# EAGLE design Vernier_Interface_Shield2 (EAGLE 6.5.0)
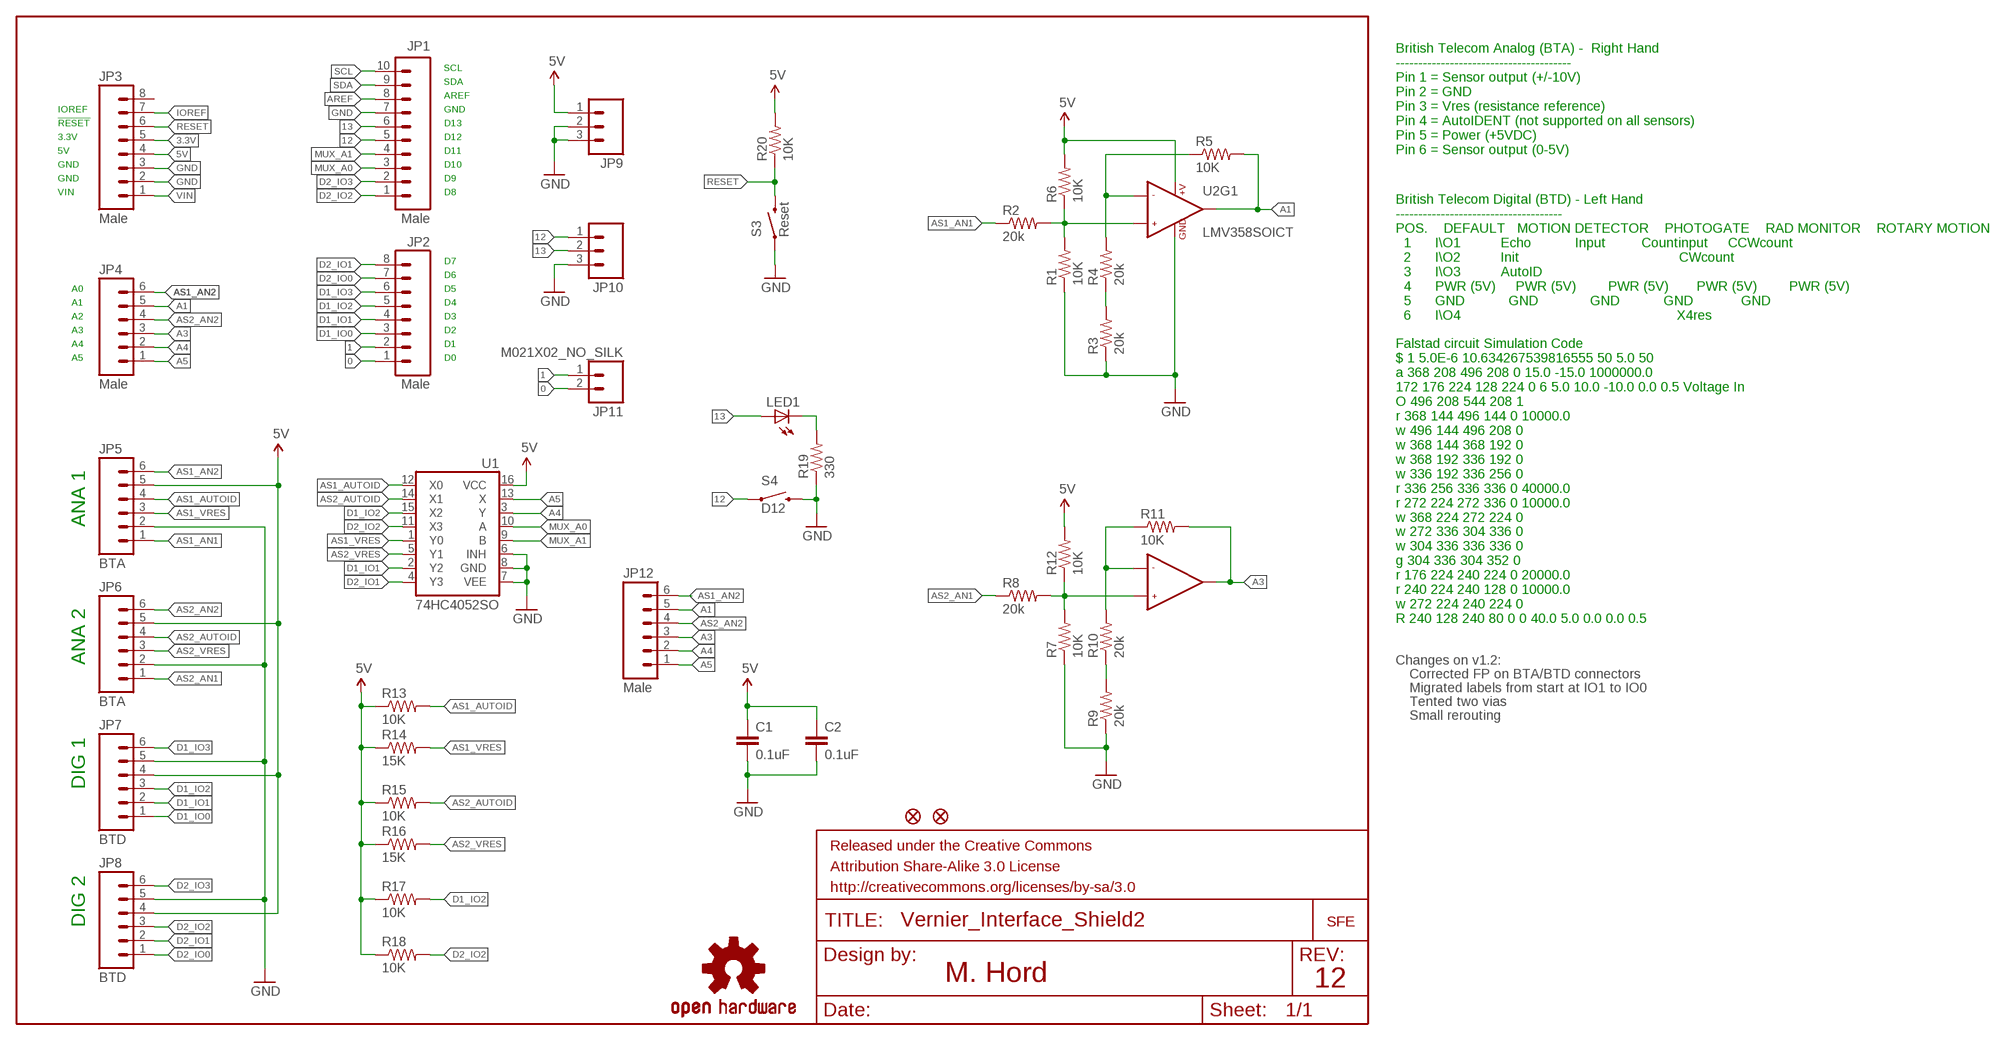
[diagram p0: schematic, sheet 1]

## Parts
C1  0.1uF  0.1UF-25V(+80/-20%)(0603)  [0603-CAP]
C2  0.1uF  0.1UF-25V(+80/-20%)(0603)  [0603-CAP]
FID1  FIDUCIALUFIDUCIAL  [MICRO-FIDUCIAL]
FID2  FIDUCIALUFIDUCIAL  [MICRO-FIDUCIAL]
FRAME1  FRAME-LETTER  [CREATIVE_COMMONS]
JP1  Male  M10SMD_MALE  [1X10_SMD_MALE]
JP2  Male  M08SMD-MALE  [1X08_SMD_MALE]
JP3  Male  M08SMD-MALE  [1X08_SMD_MALE]
JP4  Male  M06SMD_MALE  [1X06_SMD_MALE]
JP5  BTA  M06VERNIER-ANALOG  [BTA]
JP6  BTA  M06VERNIER-ANALOG  [BTA]
JP7  BTD  M06VERNIER-DIGITAL  [BTD]
JP8  BTD  M06VERNIER-DIGITAL  [BTD]
JP9  M031X03_NO_SILK  [1X03_NO_SILK]
JP10  M031X03_NO_SILK  [1X03_NO_SILK]
JP11  M021X02_NO_SILK  [1X02_NO_SILK]
JP12  Male  M06SIP  [1X06]
LED1  LED5MM  [LED5MM]
LOGO2  OSHW-LOGOS  [OSHW-LOGO-S]
LOGO_1  LOGO-SFESK  [SFE-LOGO-FLAME]
R1  10K  10KOHM1/10W1%(0603)0603  [0603-RES]
R2  20k  20KOHM1/10W1%(0603)  [0603-RES]
R3  20k  20KOHM1/10W1%(0603)  [0603-RES]
R4  20k  20KOHM1/10W1%(0603)  [0603-RES]
R5  10K  10KOHM1/10W1%(0603)0603  [0603-RES]
R6  10K  10KOHM1/10W1%(0603)0603  [0603-RES]
R7  10K  10KOHM1/10W1%(0603)0603  [0603-RES]
R8  20k  20KOHM1/10W1%(0603)  [0603-RES]
R9  20k  20KOHM1/10W1%(0603)  [0603-RES]
R10  20k  20KOHM1/10W1%(0603)  [0603-RES]
R11  10K  10KOHM1/10W1%(0603)0603  [0603-RES]
R12  10K  10KOHM1/10W1%(0603)0603  [0603-RES]
R13  10K  10KOHM1/10W1%(0603)0603  [0603-RES]
R14  15K  15KOHM1/10W1%(0603)0603  [0603-RES]
R15  10K  10KOHM1/10W1%(0603)0603  [0603-RES]
R16  15K  15KOHM1/10W1%(0603)0603  [0603-RES]
R17  10K  10KOHM1/10W1%(0603)0603  [0603-RES]
R18  10K  10KOHM1/10W1%(0603)0603  [0603-RES]
R19  330  330OHM1/10W1%(0603)  [0603-RES]
R20  10K  10KOHM1/10W1%(0603)0603  [0603-RES]
S3  Reset  SWITCH-MOMENTARY-2PTH  [TACTILE-PTH]
S4  D12  SWITCH-MOMENTARY-2PTH  [TACTILE-PTH]
U1  74HC4052SO  [SO16]
U2  LMV358SOICT  [SO08-TIGHT]

## Nets
0: JP2.1 JP11.2
1: JP2.2 JP11.1
3.3V: JP3.5
5V: C1.1 C2.1 JP3.4 JP5.5 JP6.5 JP7.4 JP8.4 JP9.1 R6.2 R12.2 R13.1 R14.1 R15.1 R16.1 R17.1 R18.1 R20.2 U1.16(VCC) U2.8(+V)
12: JP1.5 JP10.1 S4.1
13: JP1.6 JP10.2 LED1.A
A1: JP4.5 JP12.5 R5.2 U2.1(OUT1)
A3: JP4.3 JP12.3 R11.2 U2.7(OUT2)
A4: JP4.2 JP12.2 U1.3(Y)
A5: JP4.1 JP12.1 U1.13(X)
AREF: JP1.8
AS1_AN1: JP5.1 R2.1
AS1_AN2: JP4.6 JP5.6 JP12.6
AS1_AUTOID: JP5.4 R13.2 U1.12(X0)
AS1_VRES: JP5.3 R14.2 U1.1(Y0)
AS2_AN1: JP6.1 R8.1
AS2_AN2: JP4.4 JP6.6 JP12.4
AS2_AUTOID: JP6.4 R15.2 U1.14(X1)
AS2_VRES: JP6.3 R16.2 U1.5(Y1)
D1_IO0: JP2.3 JP7.1
D1_IO1: JP2.4 JP7.2 U1.2(Y2)
D1_IO2: JP2.5 JP7.3 R17.2 U1.15(X2)
D1_IO3: JP2.6 JP7.6
D2_IO0: JP2.7 JP8.1
D2_IO1: JP2.8 JP8.2 U1.4(Y3)
D2_IO2: JP1.1 JP8.3 R18.2 U1.11(X3)
D2_IO3: JP1.2 JP8.6
GND: C1.2 C2.2 JP1.7 JP3.2 JP3.3 JP5.2 JP6.2 JP7.5 JP8.5 JP9.2 JP9.3 JP10.3 R1.1 R3.1 R7.1 R9.1 R19.1 S3.1 S4.3 U1.6(INH) U1.7(VEE) U1.8(GND) U2.4(GND)
IOREF: JP3.7
MUX_A0: JP1.3 U1.10(A)
MUX_A1: JP1.4 U1.9(B)
N$1: R1.2 R2.2 R6.1 U2.3(+IN1)
N$2: R3.2 R4.1
N$3: R4.2 R5.1 U2.2(-IN1)
N$5: R9.2 R10.1
N$6: R7.2 R8.2 R12.1 U2.5(+IN2)
N$8: R10.2 R11.1 U2.6(-IN2)
N$9: LED1.K(C) R19.2
RESET: JP3.6 R20.1 S3.3
SCL: JP1.10
SDA: JP1.9
VIN: JP3.1
Unconnected: JP3.8

## Notes on the sheet
- SCL
- SDA
- AREF
- IOREF | GND
- !RESET | D13
- 3.3V | D12
- 5V | D11
- British Telecom Analog (BTA) -  Right Hand
  ---------------------------------------
  Pin 1 = Sensor output (+/-10V)
  Pin 2 = GND
  Pin 3 = Vres (resistance reference)
  Pin 4 = AutoIDENT (not supported on all sensors)
  Pin 5 = Power (+5VDC)
  Pin 6 = Sensor output (0-5V)
- GND | D10
- GND | D9
- VIN | D8
- D7
- D6
- A0 | D5
- A1 | D4
- A2 | D3
- British Telecom Digital (BTD) - Left Hand
  -------------------------------------
  POS.    DEFAULT   MOTION DETECTOR    PHOTOGATE    RAD MONITOR    ROTARY MOTION
    1      I\\O1          Echo           Input         Countinput     CCWcount 
    2      I\\O2          Init                                        CWcount 
    3      I\\O3          AutoID            
    4      PWR (5V)     PWR (5V)        PWR (5V)       PWR (5V)        PWR (5V)
    5      GND           GND             GND           GND            GND
    6      I\\O4                                                      X4res
- A3 | D2
- A4 | D1
- A5 | D0
- ANA 1
- Falstad circuit Simulation Code
  $ 1 5.0E-6 10.634267539816555 50 5.0 50
  a 368 208 496 208 0 15.0 -15.0 1000000.0
  172 176 224 128 224 0 6 5.0 10.0 -10.0 0.0 0.5 Voltage In
  O 496 208 544 208 1
  r 368 144 496 144 0 10000.0
  w 496 144 496 208 0
  w 368 144 368 192 0
  w 368 192 336 192 0
  w 336 192 336 256 0
  r 336 256 336 336 0 40000.0
  r 272 224 272 336 0 10000.0
  w 368 224 272 224 0
  w 272 336 304 336 0
  w 304 336 336 336 0
  g 304 336 304 352 0
  r 176 224 240 224 0 20000.0
  r 240 224 240 128 0 10000.0
  w 272 224 240 224 0
  R 240 128 240 80 0 0 40.0 5.0 0.0 0.0 0.5
- ANA 2 | Changes on v1.2:
- Corrected FP on BTA/BTD connectors
- Migrated labels from start at IO1 to IO0
- Tented two vias
- Small rerouting
- DIG 1
- DIG 2
- M. Hord | 12

## Library data of the parts
C1 C2 = SparkFun-Capacitors:0.1UF-25V(+80/-20%)(0603): CAP-00810 Ceramic Standard decoupling cap; PROD_ID: CAP-00810
FID1 FID2 = SparkFun-Aesthetics:FIDUCIAL: Fiducial Alignment Points Various fiducial points for machine vision alignment.
FRAME1 = SparkFun-Aesthetics:FRAME-LETTER: Schematic Frame Standard 8.5x11 US Letter frame
JP1 = SparkFun-Connectors:M10: Header 10 Standard 10-pin 0.1" header. Use with straight break away headers (SKU : PRT-00116), right angle break away headers (PRT-00553), swiss pins (PRT-00743), machine pins (PRT-00117), and female headers (PRT-00115).; PROD_ID: CONN-11291
JP2 JP3 = SparkFun-Connectors:M08: Header 8 Standard 8-pin 0.1" header. Use with straight break away headers (SKU : PRT-00116), right angle break away headers (PRT-00553), swiss pins (PRT-00743), machine pins (PRT-00117), and female headers (PRT-00115).; PROD_ID: CONN-11292
JP4 = SparkFun-Connectors:M06: Header 6 Standard 6-pin 0.1" header. Use with straight break away headers (SKU : PRT-00116), right angle break away headers (PRT-00553), swiss pins (PRT-00743), machine pins (PRT-00117), and female headers (PRT-00115). Molex polarized connector foot print use with SKU : PRT-08094 with associated crimp pins and housings. NOTES ON THE VARIANTS LOCK and LOCK_LONGPADS... This footprint was designed to help hold the alignment of a through-hole component (i.e. 6-pin header) while soldering it into place. You may notice that each hole has been shifted either up or down by 0.005 of an inch from it's more standard position (which is a perfectly straight line). This slight alteration caused the pins (the squares in the middle) to touch the edges of the holes. Because they are alternating, it causes a "brace" to hold the component in place. 0.005 has proven to be the perfect amount of "off-center" position when using our standard breakaway headers. Although looks a little odd when you look at the bare footprint, once you have a header in there, the alteration is very hard to notice. Also,if you push a header all the way into place, it is covered up entirely on the bottom side. This idea of altering the position of holes to aid alignment will be further integrated into the Sparkfun Library for other footprints. It can help hold any component with 3 or more connection pins.; PROD_ID: CONN-11293
JP5-JP8 JP12 = SparkFun-Connectors:M06: Header 6 Standard 6-pin 0.1" header. Use with straight break away headers (SKU : PRT-00116), right angle break away headers (PRT-00553), swiss pins (PRT-00743), machine pins (PRT-00117), and female headers (PRT-00115). Molex polarized connector foot print use with SKU : PRT-08094 with associated crimp pins and housings. NOTES ON THE VARIANTS LOCK and LOCK_LONGPADS... This footprint was designed to help hold the alignment of a through-hole component (i.e. 6-pin header) while soldering it into place. You may notice that each hole has been shifted either up or down by 0.005 of an inch from it's more standard position (which is a perfectly straight line). This slight alteration caused the pins (the squares in the middle) to touch the edges of the holes. Because they are alternating, it causes a "brace" to hold the component in place. 0.005 has proven to be the perfect amount of "off-center" position when using our standard breakaway headers. Although looks a little odd when you look at the bare footprint, once you have a header in there, the alteration is very hard to notice. Also,if you push a header all the way into place, it is covered up entirely on the bottom side. This idea of altering the position of holes to aid alignment will be further integrated into the Sparkfun Library for other footprints. It can help hold any component with 3 or more connection pins.
JP9 JP10 = SparkFun-Connectors:M03: Header 3 Standard 3-pin 0.1" header. Use with straight break away headers (SKU : PRT-00116), right angle break away headers (PRT-00553), swiss pins (PRT-00743), machine pins (PRT-00117), and female headers (PRT-00115). Molex polarized connector foot print use with SKU : PRT-08232 with associated crimp pins and housings.
JP11 = SparkFun-Connectors:M02: Standard 2-pin 0.1" header. Use with - straight break away headers ( PRT-00116) - right angle break away headers (PRT-00553) - swiss pins (PRT-00743) - machine pins (PRT-00117) - female headers (PRT-00115) Molex polarized connector foot print use with: PRT-08233 with associated crimp pins and housings. 2.54_SCREWTERM for use with PRT-10571. 3.5mm Screw Terminal footprints for PRT-08084 5mm Screw Terminal footprints for use with PRT-08433
LED1 = SparkFun-LED:LED: LEDs Standard schematic elements and footprints for 5mm, 3mm, 1206, and 0603 sized LEDs. 5mm - Spark Fun Electronics SKU : COM-00529 (and others)
LOGO2 = SparkFun-Aesthetics:OSHW-LOGO: Open Source Hardware Logo This logo indicates the piece of hardware it is found on incorporates a OSHW license and/or adheres to the definition of open source hardware found here: http://freedomdefined.org/OSHW
LOGO_1 = SparkFun-Aesthetics:LOGO-SFE: Spark Fun Electronics PCB Logo This is the standard Spark Fun Electronics PCB logo.
R1 R5-R7 R11-R13 R15 R17 R18 R20 = SparkFun-Resistors:10KOHM1/10W1%(0603): RES-00824; PROD_ID: RES-00824
R2-R4 R8-R10 = SparkFun-Resistors:20KOHM1/10W1%(0603): RES-09383; PROD_ID: RES-09383
R14 R16 = SparkFun-Resistors:15KOHM1/10W1%(0603): RES-07854; PROD_ID: RES-07854
R19 = SparkFun-Resistors:330OHM1/10W1%(0603): RES-00818; PROD_ID: RES-00818
S3 S4 = SparkFun-Electromechanical:SWITCH-MOMENTARY-2: Various NO switches- pushbuttons, reed, etc
U1 = SparkFun-AnalogIC:74HC4052: Dual 4:1 analog mux; PROD_ID: IC-09813; VALUE: 74HC4052
U2 = SparkFun-AnalogIC:LMV358: Jellybean rail-to-rail output op-amp; PROD_ID: IC-09657

## Board
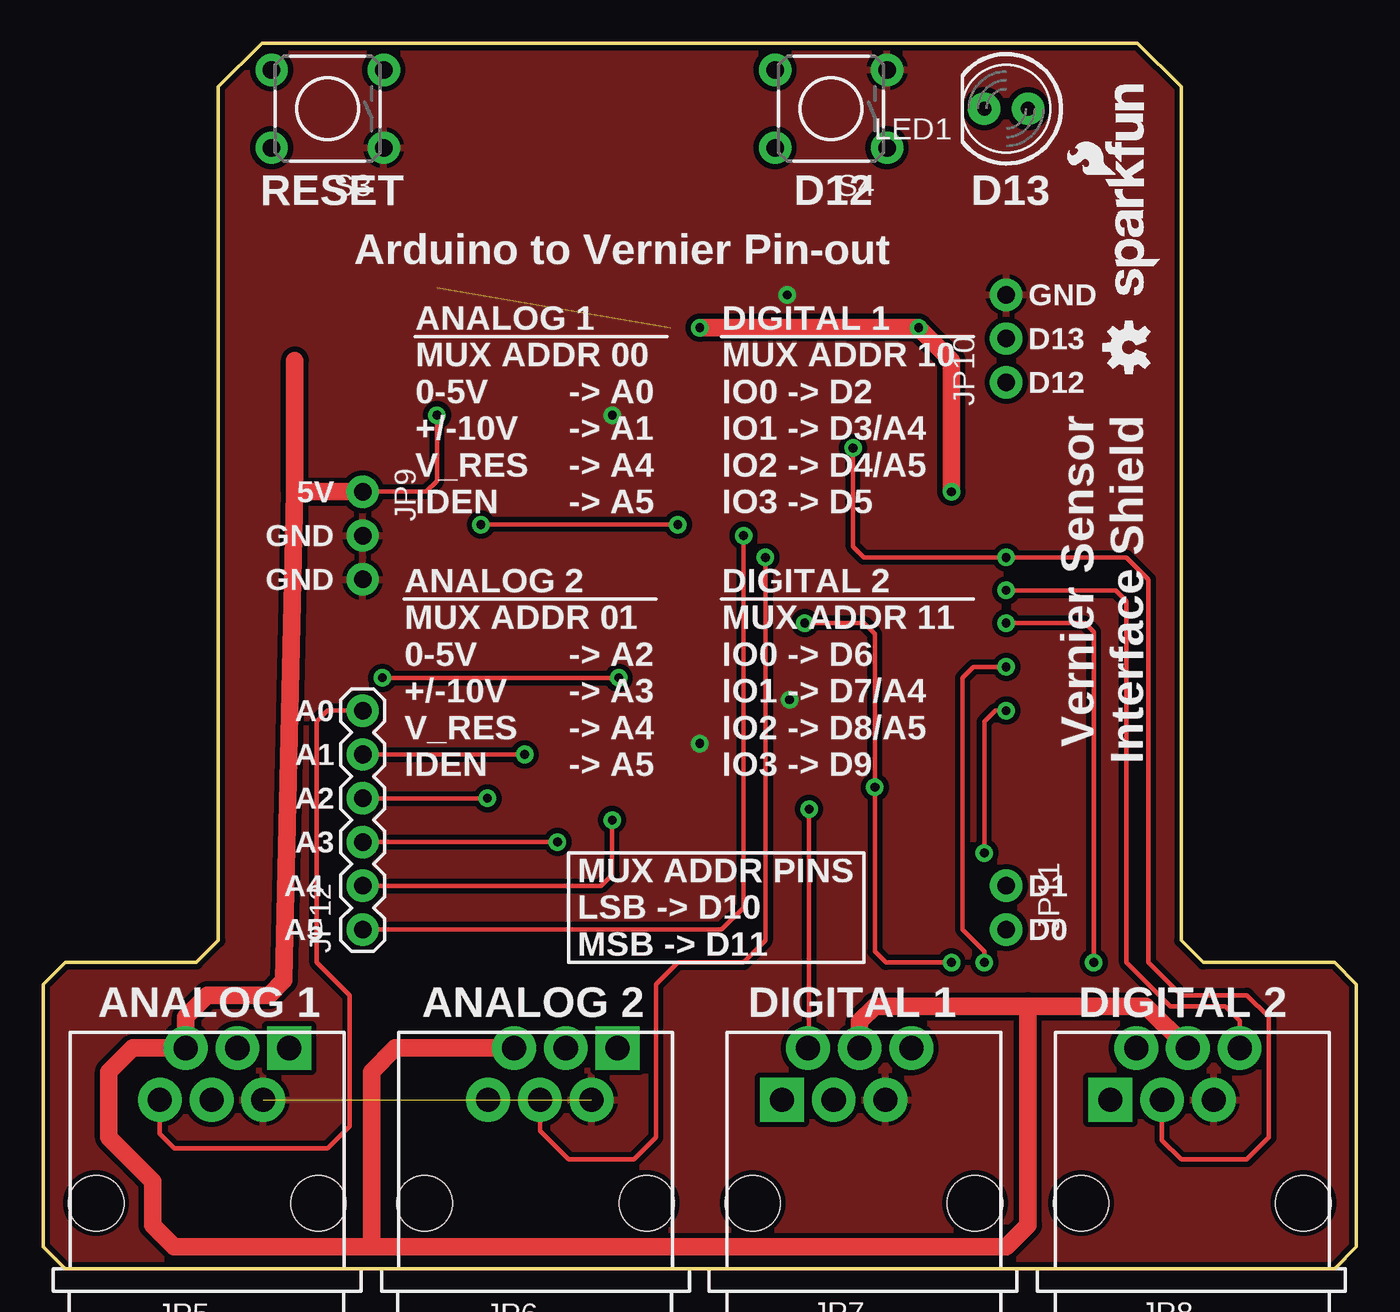
[diagram p1: board, top side]
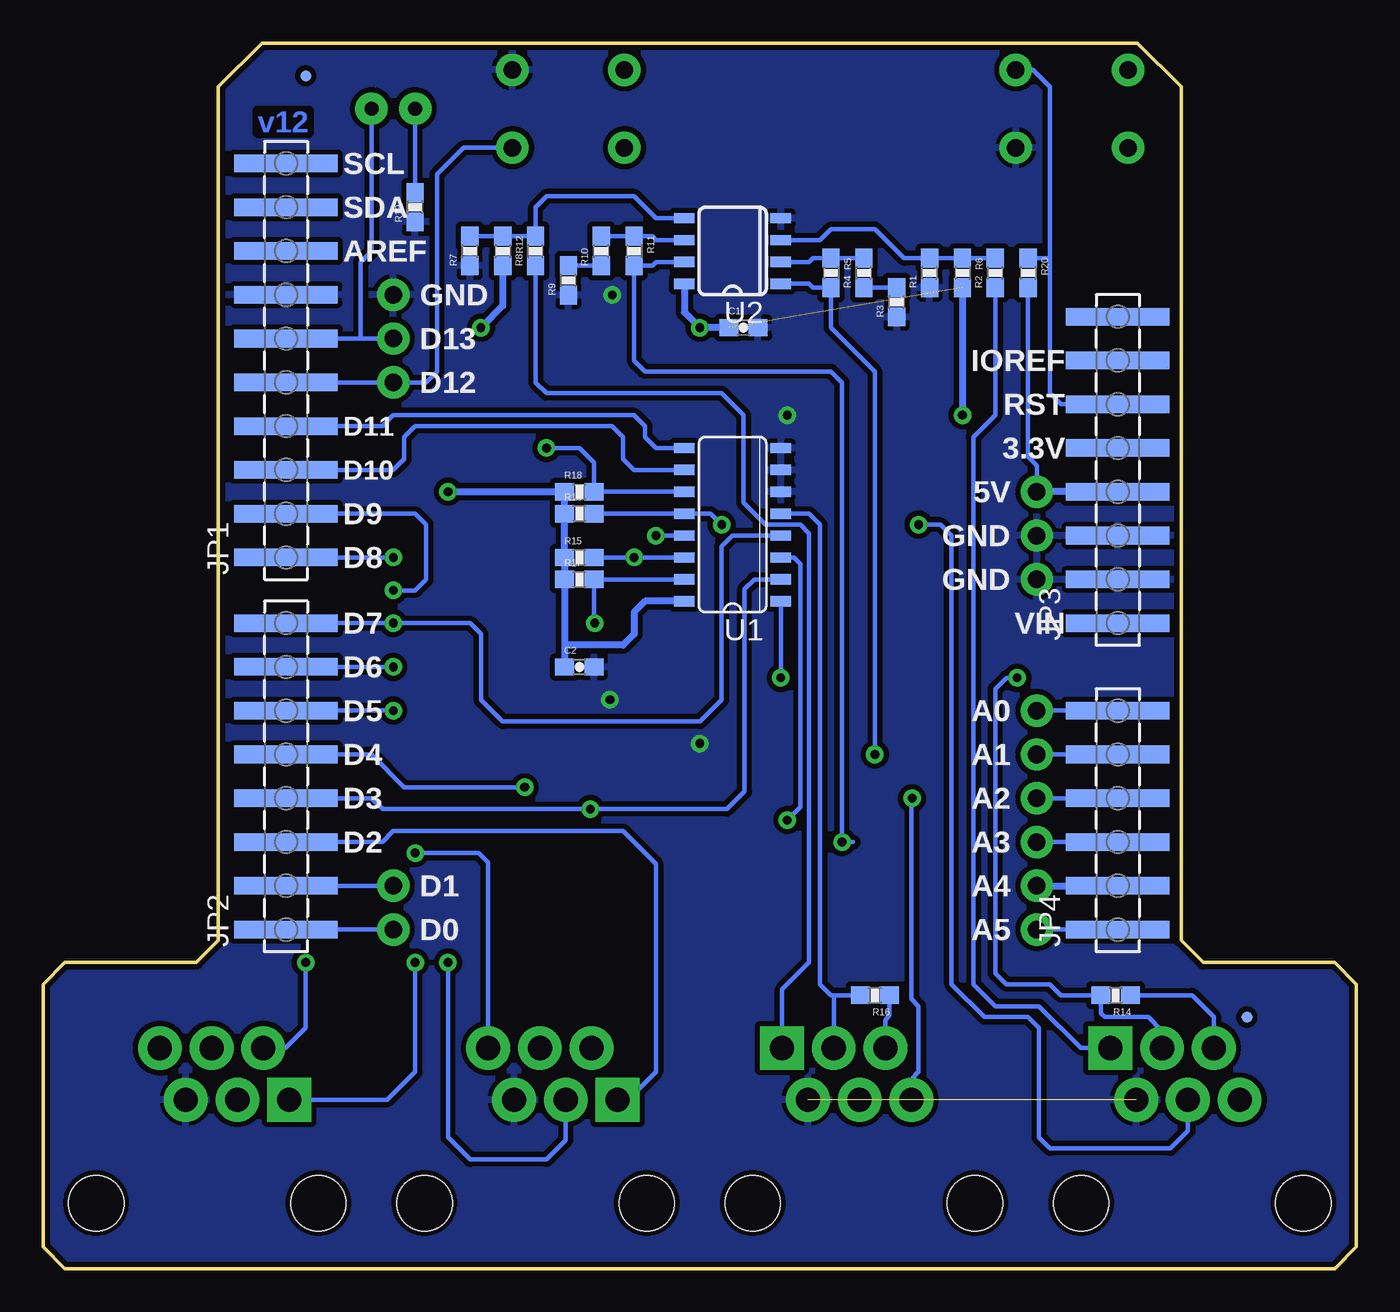
[diagram p2: board, bottom side, seen from below]

Size 76.2 x 71.12 mm. Coordinates in mm from the lower left corner, seen from the top.
Outline: 1.27,0 74.93,0 76.2,1.27 76.2,16.51 74.93,17.78 67.31,17.78 66.04,19.05 66.04,68.58 63.5,71.12 12.7,71.12 10.16,68.58 10.16,19.05 8.89,17.78 1.27,17.78 0,16.51 0,1.27 1.27,0
Copper layers (1*16): Top 0.035mm / dielectric 1.5mm / Bottom 0.035mm
Design rules "SparkFun-2-layer": minimum track width 7mil, minimum drill 15mil, track to track 8mil, track to pad 8mil, pad to pad 8mil, via to via 8mil, smd to smd 8mil, copper to edge 8mil, drill to drill 8mil, minimum pad ring 12mil, minimum via ring 10mil, stop-mask expansion 4mil, vias tented up to drill 20mil, thermal gap 10mil

### Footprints (pad centres in the part's own frame; a part is rotated, then mirrored left to right if it is on the bottom)
0603-CAP = smd 1.1 x 1: 1 -0.85,0; 2 0.85,0
MICRO-FIDUCIAL = smd 0.635 x 0.635: 1 0,0
1X10_SMD_MALE = smd 1.02 x 6: 1 0,0; 2 2.54,0; 3 5.08,0; 4 7.62,0; 5 10.16,0; 6 12.7,0; 7 15.24,0; 8 17.78,0; 9 20.32,0; 10 22.86,0
1X08_SMD_MALE = smd 1.02 x 6: 1 0,0; 2 2.54,0; 3 5.08,0; 4 7.62,0; 5 10.16,0; 6 12.7,0; 7 15.24,0; 8 17.78,0
1X06_SMD_MALE = smd 1.02 x 6: 1 0,0; 2 2.54,0; 3 5.08,0; 4 7.62,0; 5 10.16,0; 6 12.7,0
BTA = drill 1.4 pad 2.54 square: 1 4.75,9 | drill 1.4 pad 2.54: 2 3.25,6; 3 1.75,9; 4 0.25,6; 5 -1.25,9; 6 -2.75,6 | hole 3.2: 6.45,0; -6.45,0
BTD = drill 1.4 pad 2.54 square: 1 -4.75,6 | drill 1.4 pad 2.54: 2 -3.25,9; 3 -1.75,6; 4 -0.25,9; 5 1.25,6; 6 2.75,9 | hole 3.2: 6.45,0; -6.45,0
1X03_NO_SILK = drill 1.016 pad 1.88: 1 0,0; 2 2.54,0; 3 5.08,0
1X02_NO_SILK = drill 1.016 pad 1.88: 1 0,0; 2 2.54,0
1X06 = drill 1.016 pad 1.88: 1 0,0; 2 2.54,0; 3 5.08,0; 4 7.62,0; 5 10.16,0; 6 12.7,0
LED5MM = drill 0.813 pad 1.88: A -1.27,0; K 1.27,0
0603-RES = smd 1.1 x 1: 1 -0.85,0; 2 0.85,0
TACTILE-PTH = drill 1.016 pad 1.88: 1 -3.251,2.261; 2 3.251,2.261; 3 -3.251,-2.261; 4 3.251,-2.261
SO16 = smd 0.6 x 1.2: 1 -4.445,-2.8; 2 -3.175,-2.8; 3 -1.905,-2.8; 4 -0.635,-2.8; 5 0.635,-2.8; 6 1.905,-2.8; 7 3.175,-2.8; 8 4.445,-2.8; 9 4.445,2.8; 10 3.175,2.8; 11 1.905,2.8; 12 0.635,2.8; 13 -0.635,2.8; 14 -1.905,2.8; 15 -3.175,2.8; 16 -4.445,2.8
SO08-TIGHT = smd 0.6 x 1.2: 1 -1.905,-2.8; 2 -0.635,-2.8; 3 0.635,-2.8; 4 1.905,-2.8; 5 1.905,2.8; 6 0.635,2.8; 7 -0.635,2.8; 8 -1.905,2.8

### Placement (x,y rotation side)
C1  35.56,54.61 0 bottom
C2  45.09,34.92 0 bottom
FID1  6.35,14.61 90 bottom
FID2  60.96,69.22 0 bottom
FRAME1  4.17,-10.16 0 top  (outside the outline)
JP1  62.1,41.27 90 bottom
JP2  62.1,19.68 90 bottom
JP3  13.84,37.47 90 bottom
JP4  13.84,19.68 90 bottom
JP5  9.53,3.81 0 top
JP6  28.57,3.81 0 top
JP7  47.62,3.81 0 top
JP8  66.67,3.81 0 top
JP9  18.54,45.09 270 top
JP10  55.88,51.44 90 top
JP11  55.88,22.23 270 top
JP12  18.54,19.68 90 top
LED1  55.88,67.31 180 top
LOGO2  62.99,53.47 90 top
LOGO_1  62.23,63.5 90 top
LOGO_3  LOGO-SFENW2  [SFE-NEW-WEB]  64.77,56.52 90 top
R1  24.77,57.78 90 bottom
R2  20.95,57.78 90 bottom
R3  26.67,56.08 90 bottom
R4  28.57,57.78 90 bottom
R5  30.48,57.78 270 bottom
R6  22.86,57.78 270 bottom
R7  51.44,59.05 90 bottom
R8  47.62,59.05 90 bottom
R9  45.72,57.35 90 bottom
R10  43.81,59.05 90 bottom
R11  41.91,59.05 270 bottom
R12  49.53,59.05 270 bottom
R13  45.09,43.81 0 bottom
R14  13.97,15.88 180 bottom
R15  45.09,41.27 0 bottom
R16  27.94,15.88 180 bottom
R17  45.09,40.01 0 bottom
R18  45.09,45.09 0 bottom
R19  54.61,61.59 90 bottom
R20  19.05,57.78 270 bottom
S3  16.51,67.31 180 top
S4  45.72,67.31 180 top
U1  36.2,43.18 90 bottom
U2  36.2,59.05 90 bottom

### Tracks (layer width: path | path; a pad name or v marks a point on that pad's centre or on a via)
0
  Bottom 0.254: JP2.1 JP11.2
1
  Bottom 0.254: JP2.2 JP11.1
5V  (via drill 0.51)  (1 unrouted)
  Top 0.254: JP9.1 22.23,45.09 22.86,45.72 v22.86,49.53
  Top 1.016: 14.61,45.09 JP9.1 | 14.61,45.09 13.97,16.73 R14.1 9.53,15.88 8.28,14.62 JP5.5 5.19,12.81 3.81,11.43 3.81,7.62 6.35,5.08 6.35,2.54 7.62,1.27 19.05,1.27 | v38.1,54.61 v50.8,54.61 52.7,52.7 v52.7,45.09 | 57.15,15.24 48.26,15.24 47.38,14.36 JP7.4 | 57.15,15.24 63.99,15.24 JP8.4 | JP6.5 20.43,12.81 19.05,11.43 19.05,1.27 | 19.05,1.27 55.88,1.27 57.15,2.54 57.15,15.24 | 14.61,45.09 14.61,52.7
  Bottom 0.254: R14.1 9.53,15.88 8.28,14.62 JP5.5 | JP6.5 27.32,14.46 27.09,14.69 R16.1 | R20.2 19.05,47.12 18.54,46.61 JP9.1
  Bottom 0.406: 45.94,36.2 R17.1 R15.1 R13.1 R18.1 v52.7,45.09 | 45.94,36.2 C2.1 | U1.16 41.27,38.73 41.91,38.1 41.91,36.83 42.55,36.2 45.94,36.2 | R6.2 v22.86,49.53 | C1.1 v38.1,54.61 38.99,55.51 U2.8 | JP3.4 JP9.1 | R12.2 49.53,55.88 v50.8,54.61
12
  Bottom 0.254: JP1.5 JP10.1 53.98,51.44 53.34,52.07 53.34,63.5 51.79,65.05 S4.1
13
  Bottom 0.254: JP1.6 57.78,53.98 | 57.78,53.98 JP10.2 | LED1.A 57.15,59.05 57.78,58.42 57.78,53.98
A1  (via drill 0.51)
  Top 0.254: JP12.5 v27.94,29.84
  Bottom 0.254: v27.94,29.84 27.94,52.07 30.48,54.61 R5.2 31.54,56.94 31.75,57.15 U2.1 | JP4.5 JP12.5
A3  (via drill 0.51)
  Top 0.254: JP12.3 v29.84,24.77
  Bottom 0.254: U2.7 40.64,58.42 40.85,58.2 R11.2 41.91,52.7 41.27,52.07 30.48,52.07 29.84,51.44 v29.84,24.77 29.21,24.77 | JP4.3 JP12.3
A4  (via drill 0.51)
  Top 0.254: JP12.2 32.38,22.23 33.02,22.86 v33.02,26.04
  Bottom 0.254: U1.3 32.64,41.27 32.26,40.89 32.26,26.8 v33.02,26.04
  Bottom 0.406: JP12.2 JP4.2
A5  (via drill 0.51)
  Top 0.254: v40.64,42.55 40.64,20.95 39.37,19.68 JP12.1
  Bottom 0.254: U1.13 v40.64,42.55 | JP12.1 JP4.1
AS1_AN1
  Bottom 0.254: R2.1 20.95,49.53 22.23,48.26 22.23,16.51 20.95,15.24 18.41,15.24 15.98,12.81 JP5.1
AS1_AN2
  Top 0.254: JP12.6 16.51,32.38 15.88,31.75 15.88,17.78 17.78,15.88 17.78,8.26 16.51,6.99 7.62,6.99 6.78,7.83 JP5.6
  Bottom 0.254: JP12.6 JP4.6
AS1_AUTOID  (via drill 0.51)
  Top 0.254: v36.83,43.18 v25.4,43.18
  Bottom 0.254: R13.2 U1.12 37.47,43.81 v36.83,43.18 | JP5.4 9.78,8.01 10.79,6.99 17.78,6.99 18.41,7.62 18.41,13.97 19.05,14.61 21.59,14.61 23.5,16.51 23.5,42.55 24.13,43.18 v25.4,43.18
AS1_VRES  (via drill 0.51)
  Top 0.254: v19.68,34.29 v33.4,34.29
  Bottom 0.254: JP5.3 11.28,13.81 12.06,14.61 14.61,14.61 14.82,14.82 R14.2 17.14,15.88 17.78,16.51 20.32,16.51 20.95,17.14 20.95,33.66 20.32,34.29 v19.68,34.29 | U1.1 v33.4,34.3 v33.4,34.29
AS2_AN1
  Bottom 0.254: R8.1 47.62,51.44 46.99,50.8 36.83,50.8 35.56,49.53 35.56,44.45 34.29,43.18 32.26,43.18 31.75,42.67 31.75,17.78 33.33,16.2 JP6.1
AS2_AN2  (via drill 0.51)
  Top 0.254: JP12.4 v25.78,27.3
  Bottom 0.254: JP4.4 JP12.4 | v25.78,27.3 25.82,27.26 25.82,15.66 25.4,15.24 25.4,11.43 25.82,11.01 JP6.6
AS2_AUTOID  (via drill 0.51)
  Top 0.254: v41.91,41.27 41.91,19.05 40.64,17.78 36.83,17.78 35.56,16.51 35.56,7.62 34.29,6.35 30.48,6.35 28.82,8.01 JP6.4
  Bottom 0.254: R15.2 v41.91,41.27 U1.14
AS2_VRES
  Bottom 0.254: U1.5 31.75,43.81 31.11,43.18 31.11,16.51 30.48,15.88 30.35,15.88 | R16.2 30.35,15.88 | JP6.3 30.32,15.85 30.35,15.88
D1_IO0
  Bottom 0.254: JP7.1 42.26,9.81 40.64,11.43 40.64,23.5 42.55,25.4 55.88,25.4 56.52,24.77 JP2.3
D1_IO1  (via drill 0.51)
  Top 0.254: v44.45,26.67 44.45,12.88 JP7.2
  Bottom 0.254: U1.2 34.92,40.01 35.5,39.43 35.5,27.69 36.52,26.67 v44.45,26.67 56.52,26.67 57.15,27.3 JP2.4
D1_IO2  (via drill 0.51)
  Top 0.254: v44.2,37.47 47.62,37.47 48.26,36.83 v48.26,27.94 48.26,18.41 48.9,17.78 v52.7,17.78
  Bottom 0.254: U1.15 R17.2 44.23,37.5 v44.2,37.47 | v48.26,27.94 55.24,27.94 57.15,29.84 JP2.5 | v52.7,17.78 52.7,7.62 51.44,6.35 46.99,6.35 45.88,7.46 JP7.3
D1_IO3  (via drill 0.51)
  Top 0.254: v54.61,24.13 54.61,31.75 55.24,32.38 v55.88,32.38
  Bottom 0.254: v55.88,32.38 JP2.6 | v54.61,24.13 50.93,24.13 50.38,23.58 JP7.6
D2_IO0  (via drill 0.51)
  Top 0.254: v54.61,17.78 54.61,18.41 53.34,19.68 53.34,34.29 53.98,34.92 v55.88,34.92
  Bottom 0.254: JP2.7 v55.88,34.92 | JP8.1 56.23,9.81 54.61,11.43 v54.61,17.78
D2_IO1  (via drill 0.51)
  Top 0.254: v60.96,17.78 60.96,36.96 60.45,37.47 v55.88,37.47
  Bottom 0.254: JP8.2 62.12,12.81 60.96,13.97 v60.96,17.78 | U1.4 36.2,42.55 36.83,41.91 36.83,33.02 38.1,31.75 49.53,31.75 50.8,33.02 50.8,36.83 51.44,37.47 v55.88,37.47 JP2.8
D2_IO2  (via drill 0.51)
  Top 0.254: JP8.3 64.92,7.46 66.04,6.35 69.85,6.35 71.12,7.62 71.12,14.61 69.85,15.88 66.04,15.88 64.14,17.78 64.14,40.01 62.87,41.27 v55.88,41.27 47.62,41.27 46.99,41.91 v46.99,47.62
  Bottom 0.254: U1.11 R18.2 44.23,46.77 45.09,47.62 v46.99,47.62 | JP1.1 v55.88,41.27
D2_IO3  (via drill 0.51)
  Top 0.254: v55.88,39.37 62.23,39.37 62.87,38.73 62.87,17.78 65.41,15.24 68.58,15.24 69.42,14.39 JP8.6
  Bottom 0.254: JP1.2 54.61,43.81 53.98,43.18 53.98,40.01 54.61,39.37 v55.88,39.37
GND  (via drill 0.51)  (1 unrouted)
  other vias: 43.31,33.02 43.18,56.52 33.02,49.53 38.1,30.48
  pour Bottom (isolate 0.305): 10.16,68.58 12.7,71.12 63.5,71.12 66.04,68.58 66.04,19.05 67.31,17.78 74.93,17.78 76.2,16.51 76.2,1.27 74.93,0 1.27,0 0.13,1.14 0,1.14 0,16.51 1.27,17.78 8.89,17.78 10.16,19.05
  pour Top (isolate 0.305): 10.16,68.58 12.7,71.12 63.5,71.12 66.04,68.58 66.04,19.05 67.31,17.78 74.93,17.78 76.2,16.51 76.2,1.27 74.93,0 1.27,0 1.42,0.03 1.27,0.03 0,1.17 0,16.51 1.27,17.78 8.89,17.78 10.16,19.05
MUX_A0
  Bottom 0.254: U1.10 41.91,46.35 42.55,46.99 42.55,48.26 43.18,48.9 54.61,48.9 55.24,48.26 55.24,46.99 55.88,46.35 JP1.3
MUX_A1
  Bottom 0.254: U1.9 40.64,47.62 41.27,48.26 41.27,48.9 41.91,49.53 55.88,49.53 56.52,48.9 JP1.4
N$1
  Bottom 0.254: R2.2 R6.1 R1.2 26.25,58.63 27.94,60.33 30.48,60.33 31.11,59.69 U2.3
N$2
  Bottom 0.254: R4.1 R3.2
N$3
  Bottom 0.254: R4.2 R5.1 31.54,58.63 31.75,58.42 U2.2
N$5
  Bottom 0.254: R9.2 R10.1
N$6
  Bottom 0.254: U2.5 40.64,60.96 41.91,62.23 46.99,62.23 47.62,61.59 R8.2 R12.1 R7.2
N$8
  Bottom 0.254: U2.6 40.64,59.69 40.85,59.91 R11.1 R10.2
N$9
  Bottom 0.254: LED1.K R19.2
RESET
  Bottom 0.254: JP3.6 17.14,50.16 17.78,50.8 17.78,58.67 | 17.78,58.67 17.78,68.58 18.77,69.57 S3.3 | R20.1 17.82,58.63 17.78,58.67

### Text on the board
Bottom: v12
tPlace: RESET | D12 | D13 | Arduino to Vernier Pin-out | GND | D13 | D12 | Vernier Sensor / Interface Shield | 5V | ANALOG 1 / MUX ADDR 00 / 0-5V / +/-10V / V_RES / IDEN | -> A0 / -> A1 / -> A4 / -> A5 | DIGITAL 1 / MUX ADDR 10 / IO0 -> D2 / IO1 -> D3/A4 / IO2 -> D4/A5 / IO3 -> D5 | GND | GND | A0 | A1 | ANALOG 2 / MUX ADDR 01 / 0-5V / +/-10V / V_RES / IDEN | -> A2 / -> A3 / -> A4 / -> A5 | DIGITAL 2 / MUX ADDR 11 / IO0 -> D6 / IO1 -> D7/A4 / IO2 -> D8/A5 / IO3 -> D9 | A2 | A3 | A4 | D1 | A5 | D0 | MUX ADDR PINS / LSB -> D10 / MSB -> D11 | ANALOG 1 | ANALOG 2 | DIGITAL 1 | DIGITAL 2
bPlace: SCL | SDA | AREF | GND | D13 | IOREF | D12 | RST | D11 | 3.3V | D10 | 5V | D9 | GND | D8 | GND | VIN | D7 | D6 | A0 | D5 | A1 | D4 | A2 | D3 | A3 | D2 | A4 | D1 | A5 | D0
tNames: M. Hord